# Altium schematic sheet [2] - BLOCK DIAGRAM.SchDoc
size A3; DocumentNumber: 2; SheetNumber: 2; SheetTotal: 6; PageSetup: Record=PageOptions|CenterHorizontal=True|CenterVertical=True|PrintScale=0.52|XCorrection=1.00|YCorrection=1.00|PrintKind=1|BorderSize=5000000|LeftOffset=0|BottomOffset=0|Orientation=2|PaperLength=1000|PaperWidth=1000|Scale=100|PaperSource=4|PrintQuality=600|MediaType=1|DitherType=10|PrintScaleMode=1|PaperKind=A4|PaperIndex=9
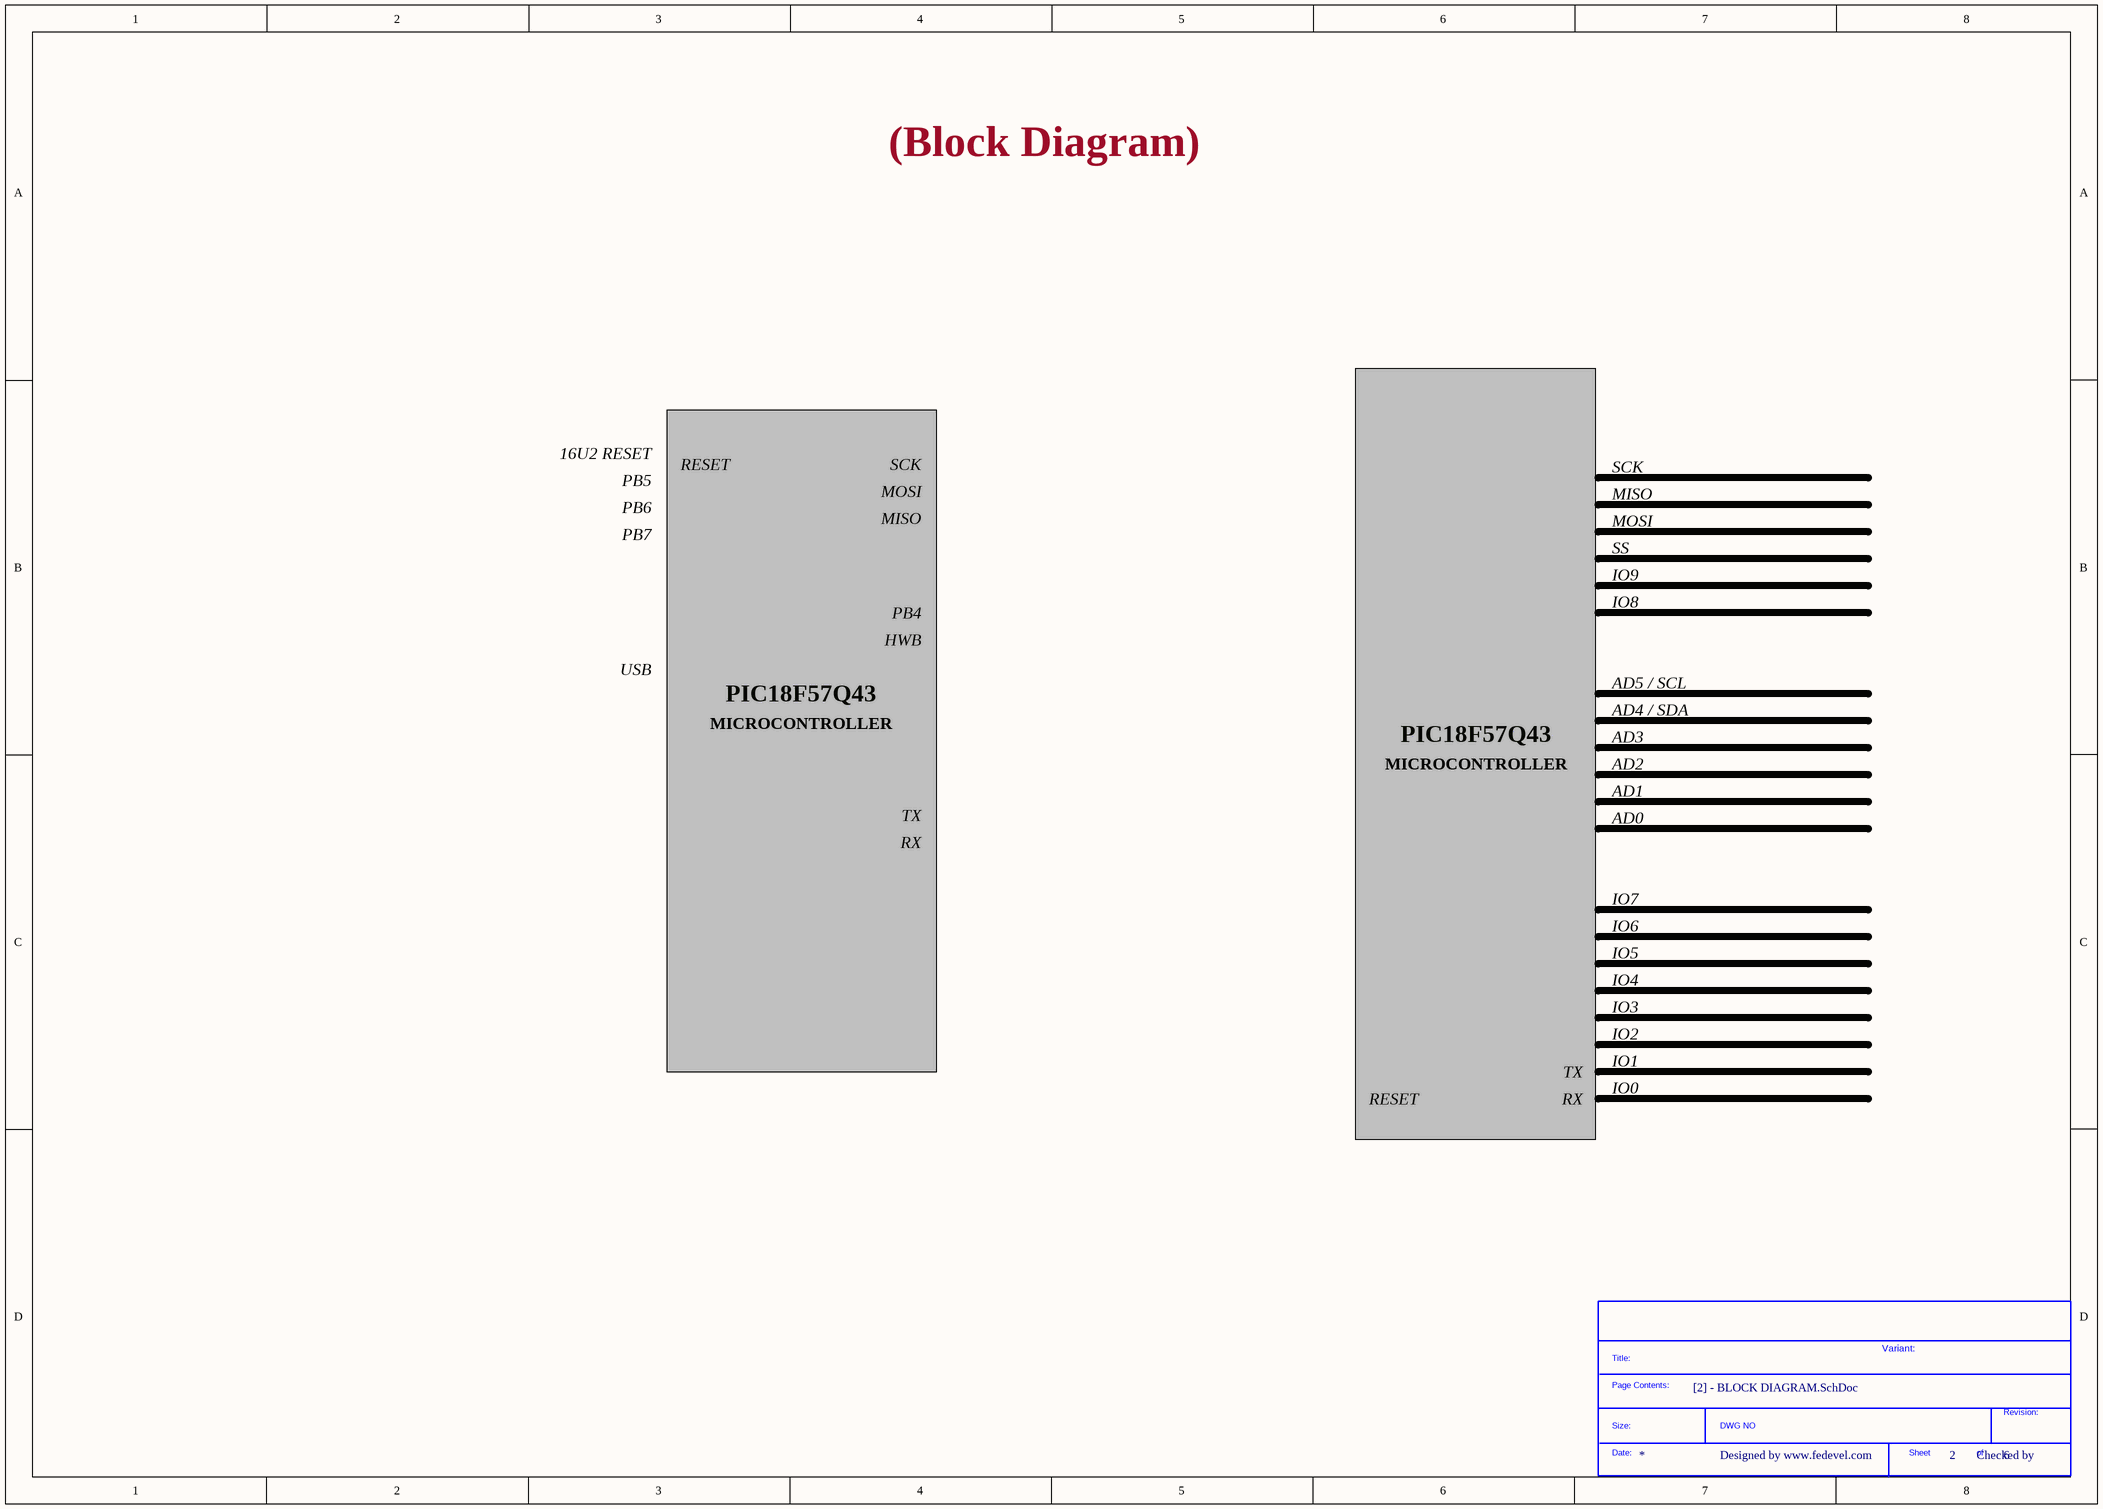
[diagram p0: [2] - BLOCK DIAGRAM.SchDoc]

## Parts
*  SDTitleBlock  (value not drawn)  (graphical)

## Notes on the sheet
- (Block Diagram)
- 16U2 RESET
- PB5
- PB6
- RESET
- MISO
- MOSI
- SCK
- PB7
- SS
- IO9
- PB4
- HWB
- IO8
- USB
- PIC18F57Q43
- AD5 / SCL
- AD4 / SDA
- MICROCONTROLLER
- AD3
- AD2
- RX
- TX
- AD1
- AD0
- IO7
- IO6
- IO5
- IO4
- IO3
- IO2
- IO1
- IO0
- Variant:
- Designed by www.fedevel.com
- Checked by
- (in symbol SDTitleBlock) Title:; Page Contents:; Revision:; Size:; DWG NO; Date:; Sheet; of